# Altium schematic sheet Ethernet.SchDoc
size A4; PageSetup: Record=PageOptions|CenterHorizontal=True|CenterVertical=True|PrintScale=0.96|XCorrection=1.00|YCorrection=1.00|PrintKind=2|BorderSize=5000000|LeftOffset=0|BottomOffset=0|Orientation=2|PaperLength=1000|PaperWidth=1000|Scale=100|PaperSource=7|PrintQuality=-4|MediaType=1|DitherType=10|PaperKind=A4|PrintScaleMode=1
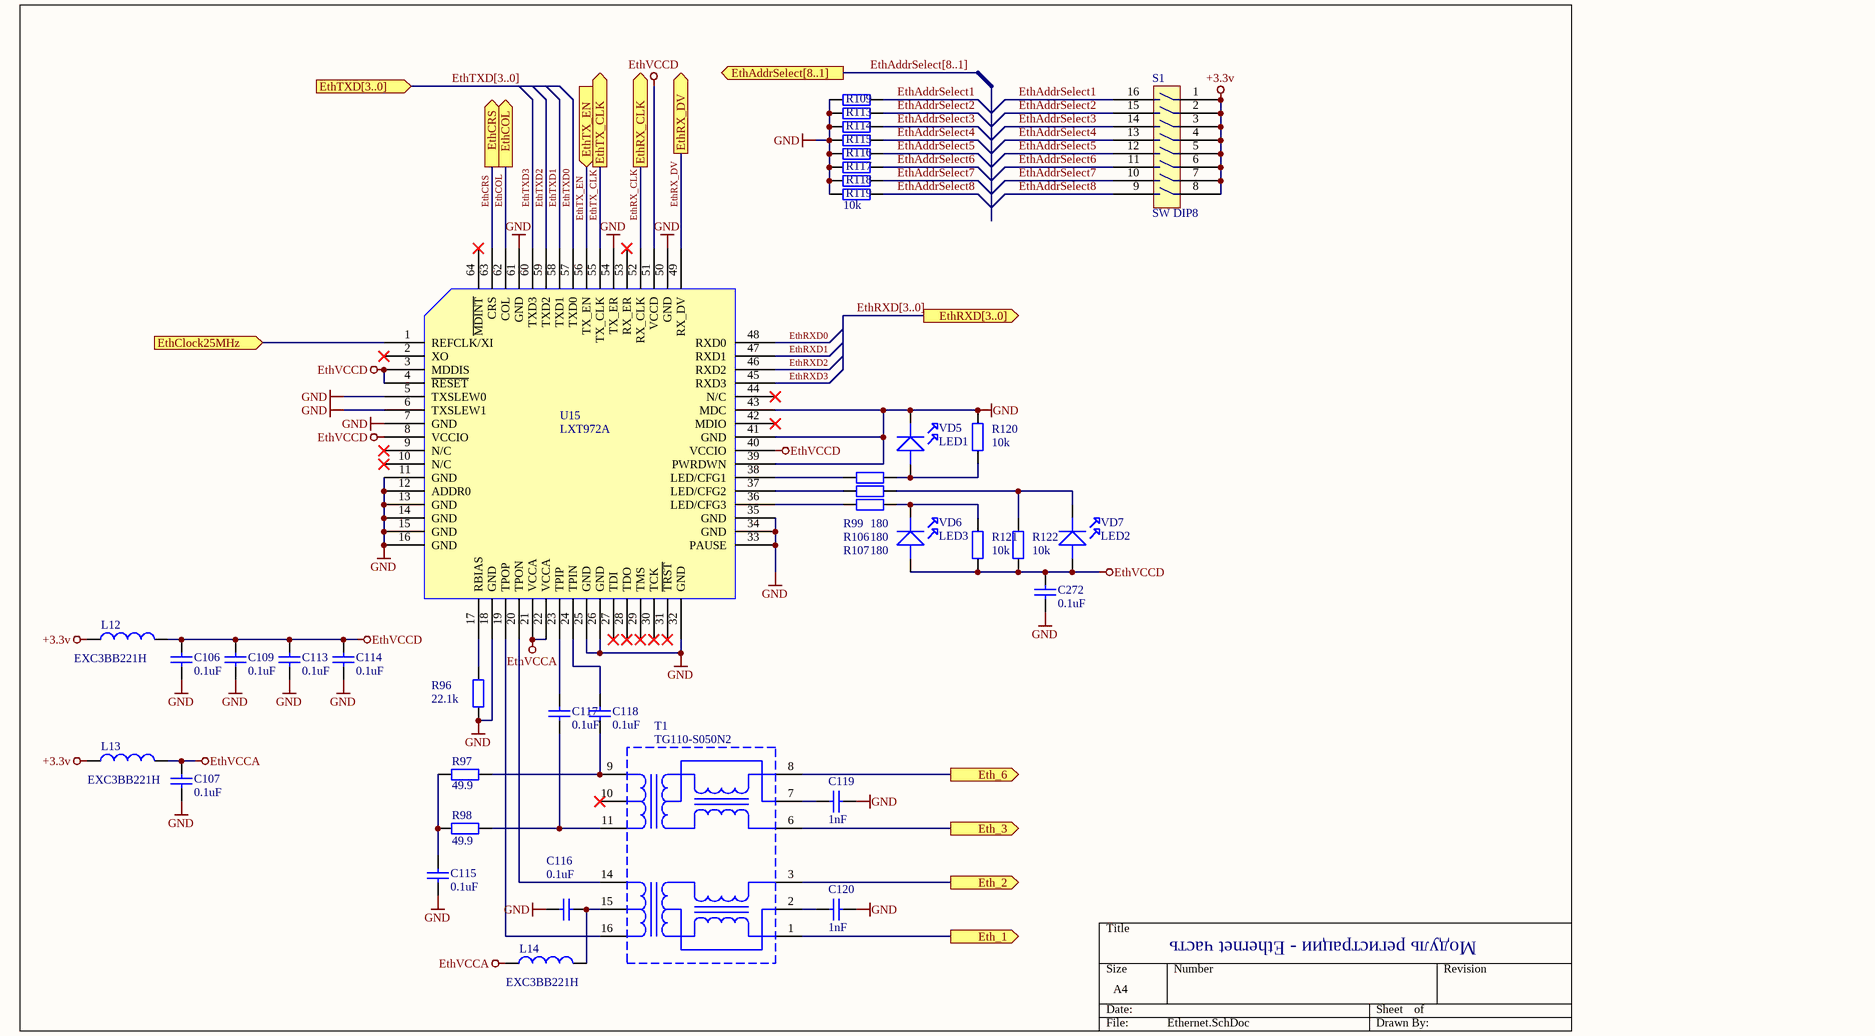
[diagram p0: Ethernet.SchDoc]

## Parts
C106  0.1uF  [0603]
C107  0.1uF  [0603]
C109  0.1uF  [0603]
C113  0.1uF  [0603]
C114  0.1uF  [0603]
C115  0.1uF  [0603]
C116  0.1uF  [0603]
C117  0.1uF  [0603]
C118  0.1uF  [0603]
C119  1nF  [0603]
C120  1nF  [0603]
C272  0.1uF  [0603]
L12  EXC3BB221H  [0603]
L13  EXC3BB221H  [0603]
L14  EXC3BB221H  [0603]
R96  22.1k  [0805]
R97  49.9  [0805]
R98  49.9  [0805]
R99  180  [0805]
R106  180  [0805]
R107  180  [0805]
R109  10k  [0603]  (value not drawn)
R113  10k  [0603]  (value not drawn)
R114  10k  [0603]  (value not drawn)
R115  10k  [0603]  (value not drawn)
R116  10k  [0603]  (value not drawn)
R117  10k  [0603]  (value not drawn)
R118  10k  [0603]  (value not drawn)
R119  10k  [0603]
R120  10k  [0603]
R121  10k  [0603]
R122  10k  [0603]
S1  SW DIP8  [SWD4-8]
T1  TG110-S050N2  [SO-G16/G6.9]
U15  LXT972A  [TQFP64]
VD5  LED1  [LED1206]
VD6  LED3  [LED1206]
VD7  LED2  [LED1206]

## Ports
Eth_1 (out), Eth_2 (out), Eth_3 (out), Eth_6 (out), EthAddrSelect[8..1] (out), EthClock25MHz (in), EthCOL (out), EthCRS (out), EthRX_CLK (out), EthRX_DV (out), EthRXD[3..0] (out), EthTX_CLK (out), EthTX_EN (in), EthTXD[3..0] (in)

## Nets
+3.3v: L12.1 L13.1 S1.1 S1.2 S1.3 S1.4 S1.5 S1.6 S1.7 S1.8
EthVCCA: C107.2 L13.2 L14.1 U15.21(VCCA) U15.22(VCCA)
EthVCCD: C106.2 C109.2 C113.2 C114.2 C272.2 L12.2 R121.1 R122.1 U15.3(MDDIS) U15.4(~{RESET}) U15.8(VCCIO) U15.40(VCCIO) U15.51(VCCD) VD6.ANODE VD7.ANODE
GND: C106.1 C107.1 C109.1 C113.1 C114.1 C115.2 C116.1 C119.2 C120.1 C272.1 R96.2 R109.2 R113.2 R114.2 R115.2 R116.2 R117.2 R118.2 R119.2 R120.2 U15.5(TXSLEW0) U15.6(TXSLEW1) U15.7(GND) U15.11(GND) U15.12(ADDR0) U15.13(GND) U15.14(GND) U15.15(GND) U15.16(GND) U15.18(GND) U15.25(GND) U15.26(GND) U15.32(GND) U15.33(PAUSE) U15.34(GND) U15.35(GND) U15.39(PWRDWN) U15.41(GND) U15.43(MDC) U15.50(GND) U15.54(TX_ER) U15.61(GND) VD5.CATHODE
Eth_1: T1.1 ; port Eth_1
Eth_2: T1.3 ; port Eth_2
Eth_3: T1.6 ; port Eth_3
Eth_6: T1.8 ; port Eth_6
EthAddrSelect1: R109.1 S1.16
EthAddrSelect2: R113.1 S1.15
EthAddrSelect3: R114.1 S1.14
EthAddrSelect4: R115.1 S1.13
EthAddrSelect5: R116.1 S1.12
EthAddrSelect6: R117.1 S1.11
EthAddrSelect7: R118.1 S1.10
EthAddrSelect8: R119.1 S1.9
EthClock25MHz: U15.1(REFCLK/XI) ; port EthClock25MHz
EthCOL: U15.62(COL) ; port EthCOL
EthCRS: U15.63(CRS) ; port EthCRS
EthRX_CLK: U15.52(RX_CLK) ; port EthRX_CLK
EthRX_DV: U15.49(RX_DV) ; port EthRX_DV
EthRXD0: U15.48(RXD0)
EthRXD1: U15.47(RXD1)
EthRXD2: U15.46(RXD2)
EthRXD3: U15.45(RXD3)
EthTX_CLK: U15.55(TX_CLK) ; port EthTX_CLK
EthTX_EN: U15.56(TX_EN) ; port EthTX_EN
EthTXD0: U15.57(TXD0)
EthTXD1: U15.58(TXD1)
EthTXD2: U15.59(TXD2)
EthTXD3: U15.60(TXD3)
NetC115_1: C115.1 R97.1 R98.2
NetC116_2: C116.2 L14.2 T1.15
NetC117_1: C117.1 R98.1 T1.11
NetC117_2: C117.2 U15.23(TPIP)
NetC118_1: C118.1 R97.2 T1.9
NetC118_2: C118.2 U15.24(TPIN)
NetC119_1: C119.1 T1.7
NetC120_2: C120.2 T1.2
NetR96_1: R96.1 U15.17(RBIAS)
NetR99_1: R99.1 U15.38(LED/CFG1)
NetR99_2: R99.2 R120.1 VD5.ANODE
NetR106_1: R106.1 U15.37(LED/CFG2)
NetR106_2: R106.2 R122.2 VD7.CATHODE
NetR107_1: R107.1 U15.36(LED/CFG3)
NetR107_2: R107.2 R121.2 VD6.CATHODE
NetT1_14: T1.14 U15.20(TPON)
NetT1_16: T1.16 U15.19(TPOP)

Not connected (* = marked no-connect by the designer): T1 10*; U15 2(XO)* 9(N/C)* 10(N/C)* 27(TDI)* 28(TDO)* 29(TMS)* 30(TCK)* 31(~{TRST})* 42(MDIO)* 44(N/C)* 53(RX_ER)* 64(~{MDINT})*

## Buses and harness runs
bus EthAddrSelect[8..1] = port EthAddrSelect[8..1]
bus EthRXD[3..0] = port EthRXD[3..0]
bus EthTXD[3..0] = port EthTXD[3..0]

## Notes on the sheet
- Модуль регистрации - Ethernet часть

## Library data of the parts
C106 C107 C109 C113-C120 C272 = Cap: Capacitor; Published: 8-Jun-2000; LatestRevisionDate: 17-Jul-2002; LatestRevisionNote: Re-released for DXP Platform.; Publisher: Altium Limited
  C106 C107 C109 C113-C118 C272: Value: 0.1uF
  C119 C120: Value: 1nF
L12-L14 = INDUCTOR
R96-R99 R106 R107 R109 R113-R122 = Res2: Resistor; Published: 8-Jun-2000; LatestRevisionDate: 17-Jul-2002; LatestRevisionNote: Re-released for DXP Platform.; Publisher: Altium Limited; PackageReference: AXIAL-0.4
  R96: Value: 22.1k
  R97 R98: Value: 49.9
  R99 R106 R107: Value: 180
  R109 R113-R122: Value: 10k
VD6 VD7 = LED1